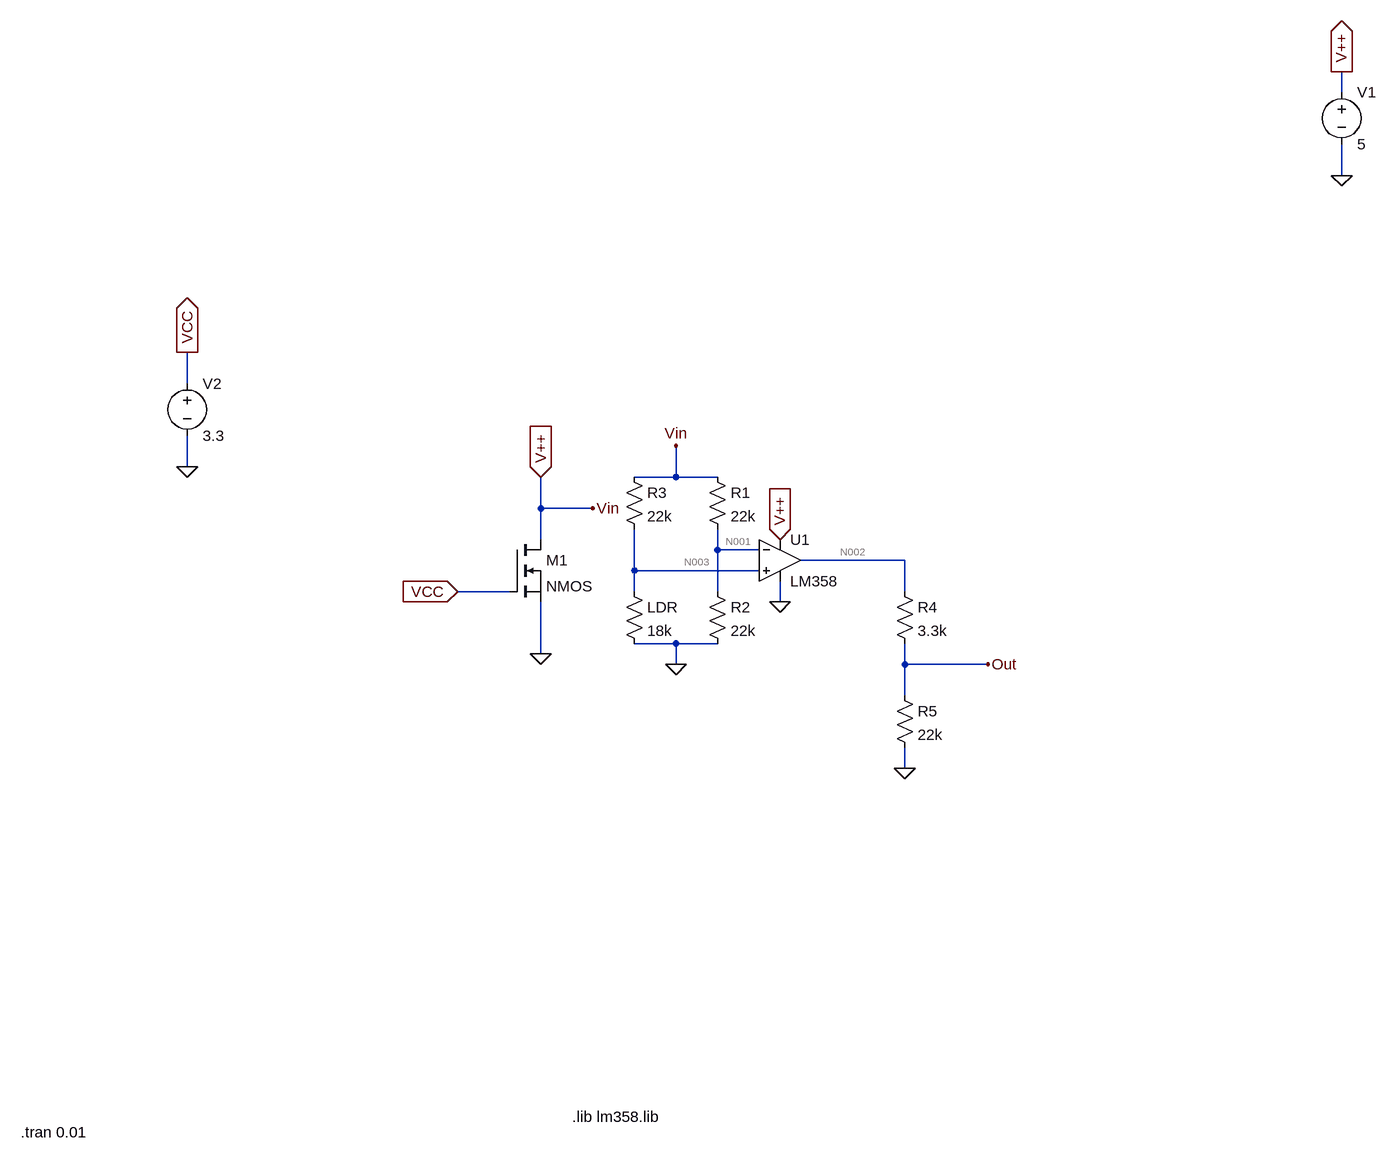
[diagram p0: schematic LDR_Circuit.asc]
LDR_Circuit.asc, the LTspice schematic file:
Version 4
SHEET 1 4800 756
WIRE 1072 -1344 1072 -1376
WIRE 1072 -1216 1072 -1264
WIRE -704 -896 -704 -944
WIRE -704 -768 -704 -816
WIRE 48 -752 48 -800
WIRE 48 -752 -16 -752
WIRE 112 -752 48 -752
WIRE -160 -704 -160 -752
WIRE -80 -704 -160 -704
WIRE -160 -656 -160 -704
WIRE 112 -640 112 -672
WIRE 176 -640 112 -640
WIRE 400 -624 240 -624
WIRE -16 -608 -16 -672
WIRE 176 -608 -16 -608
WIRE -208 -576 -288 -576
WIRE -16 -576 -16 -608
WIRE 112 -576 112 -640
WIRE 400 -576 400 -624
WIRE 208 -560 208 -592
WIRE 48 -496 -16 -496
WIRE 112 -496 48 -496
WIRE -160 -480 -160 -560
WIRE 48 -464 48 -496
WIRE 400 -464 400 -496
WIRE 528 -464 400 -464
WIRE 400 -416 400 -464
WIRE 400 -304 400 -336
FLAG 528 -464 Out
FLAG 1072 -1216 0
FLAG 1072 -1376 V++
IOPIN 1072 -1376 Out
FLAG 48 -464 0
FLAG 208 -560 0
FLAG 208 -656 V++
IOPIN 208 -656 In
FLAG -160 -752 V++
IOPIN -160 -752 In
FLAG 400 -304 0
FLAG -160 -480 0
FLAG -288 -576 VCC
IOPIN -288 -576 In
FLAG 48 -800 Vin
FLAG -80 -704 Vin
FLAG -704 -768 0
FLAG -704 -944 VCC
IOPIN -704 -944 Out
SYMBOL OpAmps\\opamp2 208 -688 R0
SYMATTR InstName U1
SYMATTR Value LM358
SYMBOL res 96 -768 R0
SYMATTR InstName R1
SYMATTR Value 22k
SYMBOL voltage 1072 -1360 R0
WINDOW 123 0 0 Left 0
WINDOW 39 0 0 Left 0
SYMATTR InstName V1
SYMATTR Value 5
SYMBOL res 96 -592 R0
SYMATTR InstName R2
SYMATTR Value 22k
SYMBOL res -32 -592 R0
SYMATTR InstName LDR
SYMATTR Value 18k
SYMBOL res -32 -768 R0
SYMATTR InstName R3
SYMATTR Value 22k
SYMBOL res 384 -592 R0
SYMATTR InstName R4
SYMATTR Value 3.3k
SYMBOL res 384 -432 R0
SYMATTR InstName R5
SYMATTR Value 22k
SYMBOL nmos -208 -656 R0
SYMATTR InstName M1
SYMBOL voltage -704 -912 R0
WINDOW 123 0 0 Left 0
WINDOW 39 0 0 Left 0
SYMATTR InstName V2
SYMATTR Value 3.3
TEXT -112 232 Left 2 !.lib lm358.lib
TEXT -960 256 Left 2 !.tran 0.01

The netlist it stands for:
* LDR_Circuit.asc
XU1 N003 N001 Vin 0 N002 LM358  ; pins In+ In- V+ V- OUT
R1 Vin N001 22k
V1 Vin 0 5
R2 N001 0 22k
R§LDR N003 0 18k
R3 Vin N003 22k
R4 N002 Out 3.3k
R5 Out 0 22k
M1 Vin VCC 0 0 NMOS
V2 VCC 0 3.3
.model NMOS NMOS
.model PMOS PMOS
.lib standard.mos
.lib lm358.lib
.tran 0.01
.backanno
.end

* Results of the author's LTspice run, read from the files saved beside the schematic
* Operating Point, zero values left out:
*   V(n002) = 23.79 mV
*   V(vin) = 5 V
*   V(n001) = 2.5 V
*   V(n003) = 2.25 V
*   V(out) = 20.69 mV
*   V(vcc) = 3.3 V
*   Id(M1) = 108.9 µA
*   Ib(M1) = -5.01 pA
*   Is(M1) = -108.9 µA
*   I(R5) = 940.3 nA
*   I(R4) = 940.3 nA
*   I(R3) = 125 µA
*   I(Ldr) = 125 µA
*   I(R2) = 113.6 µA
*   I(R1) = 113.6 µA
*   I(V1) = -698.5 µA
*   Ix(u1:IN+) = -20 nA
*   Ix(u1:IN-) = -18 nA
*   Ix(u1:VCC) = 350.9 µA
*   Ix(u1:VEE) = -350 µA
*   Ix(u1:OUT) = -940.3 nA